# Altium project Multi_HUTSCHIENE_1_1.PrjPCB
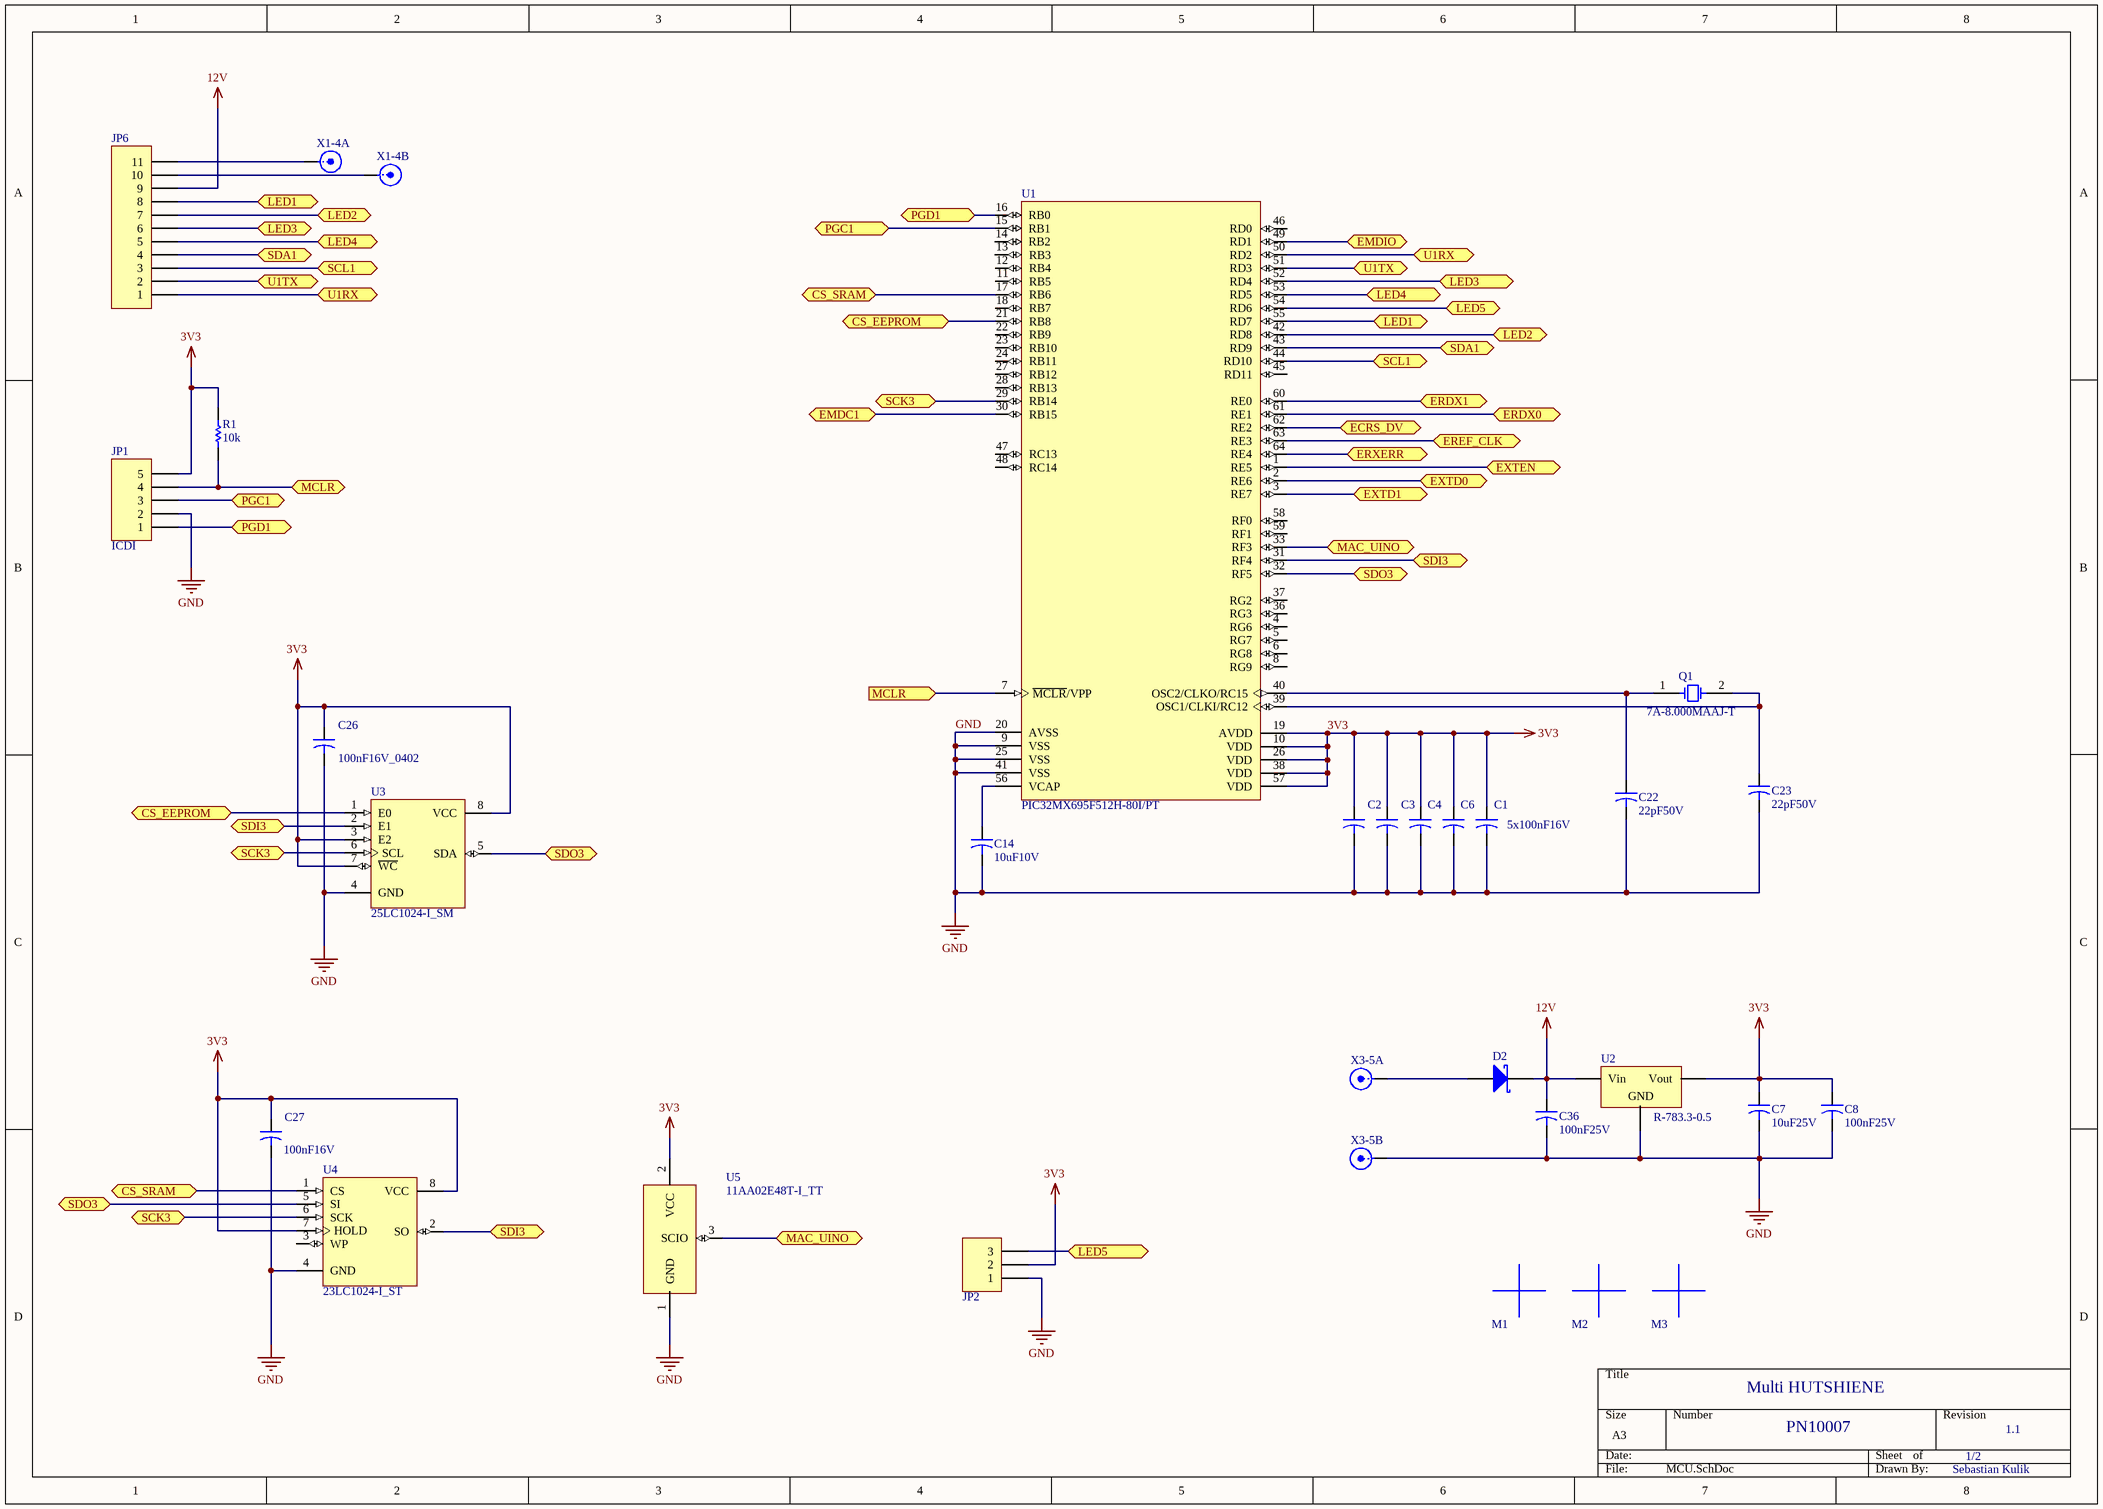
[diagram p0: MCU.SchDoc]
2 sheets, 60 parts. Net scope: flat (ports and power ports of the same name join across sheets).
Board file: Multi_HUTSCHIENE_1_1.PcbDoc
Sheets:
  MCU.SchDoc
  Ethernet.SchDoc

## Sheet MCU.SchDoc
size A3

### Parts
C1  100nF16V_0402  [C0402]  (value not drawn)
C2  100nF16V_0402  [C0402]  (value not drawn)
C3  100nF16V_0402  [C0402]  (value not drawn)
C4  100nF16V_0402  [C0402]  (value not drawn)
C6  100nF16V_0402  [C0402]  (value not drawn)
C7  value 10uF25V  [C1210]  (hidden comment: 10uF25V_1210)
C8  value 100nF25V  [C0402]  (hidden comment: 100nF25V_0402)
C14  value 10uF10V  [C0603]  (hidden comment: 10uF10V_0603)
C22  value 22pF50V  [C0402]  (hidden comment: 22pF50V_0402)
C23  value 22pF50V  [C0402]  (hidden comment: 22pF50V_0402)
C26  100nF16V_0402  [C0402]
C27  value 100nF16V  [C0402]  (hidden comment: 100nF16V_0402)
C36  value 100nF25V  [C0402]  (hidden comment: 100nF25V_0402)
D2  SD103AW-V-GS08  [SOD123]  (value not drawn)
JP1  ICDI  [HDR1X5-1.27]
JP2  Header-3  [HDR1X3]  (value not drawn)
JP6  Header 11_2.54  [HDR1X11_2.54]  (value not drawn)
M1  Mark  [Mark-3mm]  (value not drawn)
M2  Mark  [Mark-3mm]  (value not drawn)
M3  Mark  [Mark-3mm]  (value not drawn)
Q1  7A-8.000MAAJ-T  [TXC_7A]
R1  value 10k  [R0402]  (hidden comment: 10k_0402)
U1  PIC32MX695F512H-80I/PT  [TQFP-64_N1]
U2  R-783.3-0.5  [R-783_3-0_5]
U3  25LC1024-I_SM  [SOP8_N]
U4  23LC1024-I_ST  [TSSOP8]
U5  11AA02E48T-I_TT  [SOT23_M]
X1-4  Terminal-Wago_2  [WAGO-243-211]  (value not drawn)  (parts A,B of 2)
X3-5  Terminal-Wago_2  [WAGO-243-211]  (value not drawn)  (parts A,B of 2)

### Ports
CS_EEPROM, CS_SRAM, ECRS_DV, EMDC1, EMDIO, ERDX0, ERDX1, EREF_CLK, ERXERR, EXTD0, EXTD1, EXTEN, LED1, LED2, LED3, LED4, LED5, MAC_UINO, MCLR, MCLR (in), PGC1, PGD1, SCK3, SCL1, SDA1, SDI3, SDO3, U1RX, U1TX

### Nets
3V3: C1.1 C2.1 C3.1 C4.1 C6.1 C7.1 C8.1 C26.1 C27.1 JP1.5 JP2.2 R1.2 U1.10(VDD) U1.19(AVDD) U1.26(VDD) U1.38(VDD) U1.57(VDD) U2.3(Vout) U3.3(E2) U3.7(~{WC}) U3.8(VCC) U4.7(HOLD) U4.8(VCC) U5.2(VCC)
12V: C36.1 D2.1(K) JP6.9 U2.1(Vin)
GND: C1.2 C2.2 C3.2 C4.2 C6.2 C7.2 C8.2 C14.2 C22.2 C23.2 C26.2 C27.2 C36.2 JP1.2 JP2.1 U1.9(VSS) U1.20(AVSS) U1.25(VSS) U1.41(VSS) U2.2(GND) U3.4(GND) U4.4(GND) U5.1(GND) X3-5.2(Y)
NetC14_1: C14.1 U1.56(VCAP)
NetC22_1: C22.1 Q1.1(E/D) U1.40(OSC2/CLKO/RC15)
NetC23_1: C23.1 Q1.2(GND) U1.39(OSC1/CLKI/RC12)
NetD2_2: D2.2(A) X3-5.1(X)
NetJP1_1: JP1.1 U1.16(RB0) ; port PGD1
NetJP1_3: JP1.3 U1.15(RB1) ; port PGC1
NetJP1_4: JP1.4 R1.1 U1.7(~{MCLR}/VPP) ; port MCLR
NetJP2_3: JP2.3 U1.54(RD6) ; port LED5
NetJP6_1: JP6.1 U1.50(RD2) ; port U1RX
NetJP6_2: JP6.2 U1.51(RD3) ; port U1TX
NetJP6_3: JP6.3 U1.44(RD10) ; port SCL1
NetJP6_4: JP6.4 U1.43(RD9) ; port SDA1
NetJP6_5: JP6.5 U1.53(RD5) ; port LED4
NetJP6_6: JP6.6 U1.52(RD4) ; port LED3
NetJP6_7: JP6.7 U1.42(RD8) ; port LED2
NetJP6_8: JP6.8 U1.55(RD7) ; port LED1
NetJP6_10: JP6.10 X1-4.2(Y)
NetJP6_11: JP6.11 X1-4.1(X)
NetR9_1: U1.49(RD1) ; port EMDIO
NetR10_2: U1.62(RE2) ; port ECRS_DV
NetR11_2: U1.64(RE4) ; port ERXERR
NetR12_1: U1.60(RE0) ; port ERDX1
NetR13_2: U1.61(RE1) ; port ERDX0
NetR15_2: U1.63(RE3) ; port EREF_CLK
NetU1_1: U1.1(RE5) ; port EXTEN
NetU1_2: U1.2(RE6) ; port EXTD0
NetU1_3: U1.3(RE7) ; port EXTD1
NetU1_17: U1.17(RB6) U4.1(CS) ; port CS_SRAM
NetU1_21: U1.21(RB8) U3.1(E0) ; port CS_EEPROM
NetU1_29: U1.29(RB14) U3.6(SCL) U4.6(SCK) ; port SCK3
NetU1_30: U1.30(RB15) ; port EMDC1
NetU1_31: U1.31(RF4) U3.2(E1) U4.2(SO) ; port SDI3
NetU1_32: U1.32(RF5) U3.5(SDA) U4.5(SI) ; port SDO3
NetU1_33: U1.33(RF3) U5.3(SCIO) ; port MAC_UINO

Not connected (* = marked no-connect by the designer): U1 4(RG6) 5(RG7) 6(RG8) 8(RG9) 11(RB5) 12(RB4) 13(RB3) 14(RB2) 18(RB7) 22(RB9) 23(RB10) 24(RB11) 27(RB12) 28(RB13) 36(RG3) 37(RG2) 45(RD11) 46(RD0) 47(RC13) 48(RC14) 58(RF0) 59(RF1); U4 3(WP)

### Notes on the sheet
- (near C1) 5x100nF16V
- Multi HUTSHIENE
- PN10007
- 1/2
- 1.1
- Sebastian Kulik

### Library data of the parts
C1-C4 C6 C26 C27 = 100nF16V_0402: Capacitor; Part Description: TDK. CGA series, X7R, 10%, 16V; Deliverer PartNr: 2210748RL; Manufacturer: TDK; Manufacturer PartNr: CGA2B1X7R1C104K050BC; Deliverer: Farnell; TDFE-PN: C0025; Published: 12.02.2014; Publisher: Sebastian Kulik; PackageDescription: C0403
  C1-C4 C6 C26: Value: 100nF16V
C7 = 10uF25V_1210: Capacitor; Part Description: TDK  C series, X5R, 10%, 25V; Deliverer PartNr: 2346957; Manufacturer: TDK; Manufacturer PartNr: C3225X5R1E106K250AA; Deliverer: Farnell; TDFE-PN: C0014; Published: 12.02.2014; Publisher: Sebastian Kulik; PackageDescription: C1210
C8 C36 = 100nF25V_0402: AVX, X5R, 10%, 25V; Deliverer PartNr: 2280767; Manufacturer PartNr: 04023D104KAT2A; Deliverer: Farnell; TDFE-PN: C0036; Published: 13.02.2014; Part Description: AVX, X5R, 10%, 25V; Publisher: Sebastian Kulik; PackageDescription: C0403; Manufacturer: AVX
C14 = 10uF10V_0603: Capacitor; Part Description: AVX ,  X5R, 20%, 10V; Deliverer PartNr: 1867954RL; Manufacturer: AVX; Manufacturer PartNr: 0603ZD106MAT2A; Deliverer: Farnell; TDFE-PN: C0016; Published: 11.02.2014; Publisher: Sebastian Kulik; PackageDescription: C0603
C22 C23 = 22pF50V_0402: Murata, GRM series, 50V; Deliverer PartNr: 8819629RL; Manufacturer PartNr: GRM1555C1H220JZ01D; Deliverer: Farnell; TDFE-PN: C0021; Published: 11.02.2014; Part Description: Murata, GRM series, 50V; Publisher: Sebastian Kulik; PackageDescription: C0403; Manufacturer: Murata
D2 = SD103AW-V-GS08: Diode Schottky,2A,40V; Deliverer PartNr: 1617720RL; Manufacturer: Vishay; TDE-PN: DIS0008; Deliverer: Farnell; Published: 12.02.2014; PackageReference: TO-220AC; Publisher: Sebastian Kulik; PackageDescription: SOD123; Manufacturer PartNr: SD103AW-V-GS08
JP1 = ICDI: Header, 5-Pin; LatestRevisionDate: 17-Jul-2002; LatestRevisionNote: Re-released for DXP Platform.; Publisher: Sebastian Kulik
JP2 = Header-3: Header-3-Pin; Publisher: Sebastian Kulik
JP6 = Header 11_2.54: Header, 11-Pin; LatestRevisionDate: 17-Jul-2002; LatestRevisionNote: Re-released for DXP Platform.; Publisher: Altium Limited
Q1 = Crystal_8MHz: Crystal, 7A-8.000MAAJ-T; Deliverer PartNr: 1892148; Manufacturer: TXC; Deliverer: Farnell; TDE-PN: P0003; Published: 14.02.2014; PackageReference: 7A; Publisher: Sebastian Kulik; Manufacturer PartNr: 7A-8.000MAAJ-T
R1 = 10k_0402: Vishay CRCW series, 125mW, 1%; Manufacturer PartNr: CRCW040210K0FKEAHP; Deliverer PartNr: 1738864; TDE-PN: R0012; Deliverer: Farnell; Published: 12.02.2014; PackageReference: 0402; Publisher: Sebastian Kulik; PackageDescription: 0402; Manufacturer: Vishay; Part Description: Vishay CRCW series, 125mW, 1%
U1 = PIC32MX695F512H-80I/PT: High Performance ROM-less Microcontroller with External Memory Bus, 1.5K RAM, 64-Pin TQFP, 4.2 to 5.5V Supply Range, Industrial Temperature; Deliverer PartNr: 1778975; Manufacturer: Microchip; Deliverer: Farnell; TDE-PN: IC0031; Published: 11.02.2014; PackageReference: TQFP-64; Publisher: Sebastian Kulik; PackageDescription: 64-Pin Thin Plastic Quad Flat Pack 0.5 mm Pitch, 1.0/0.1 mm Lead Form; Manufacturer PartNr: PIC32MX695F512H-80I/PT
U2 = Recom-R-783_3-0_5: Voltage Regulator; Manufacturer: Recom; TDE-PN: IC0032; Published: 12.02.2014; Manufacturer PartNr: R-783.3-0.5; PackageReference: D2PAK; Publisher: Sebastian Kulik
U3 = 25LC1024-I_SM: 1024 Kbit Serial SPI Bus EEPROM; Deliverer PartNr: 1331393; Manufacturer: Microchip; Deliverer: Farnell; TDE-PN: IC0033; Published: 12.02.2014; PackageReference: SOP8; Publisher: Sebastian Kulik; Manufacturer PartNr: 25LC1024-I_SM
U4 = 23LC1024-I_ST: 1 Mbit Serial  EEPROM; Deliverer PartNr: 2212151; Manufacturer PartNr: 23LC1024-I/ST; Manufacturer: Microchip; Deliverer: Farnell; TDE-PN: IC0034; Published: 12.02.2014; PackageReference: TSSOP8; Publisher: Sebastian Kulik
U5 = 11AA02E48T-I_TT: 2 kbit Serial  EEPROM; Deliverer PartNr: 1707616RL; Manufacturer PartNr: 11AA02E48T-I/TT; Manufacturer: Microchip; Deliverer: Farnell; TDE-PN: IC0035; Published: 12.02.2014; PackageReference: SOT23; Publisher: Sebastian Kulik
X1-4 X3-5 = Terminal-Wago_2: Wago terminal-2; LatestRevisionDate: 17-Jul-2002; LatestRevisionNote: Re-released for DXP Platform.; Publisher: Altium Limited

## Sheet Ethernet.SchDoc
size A3
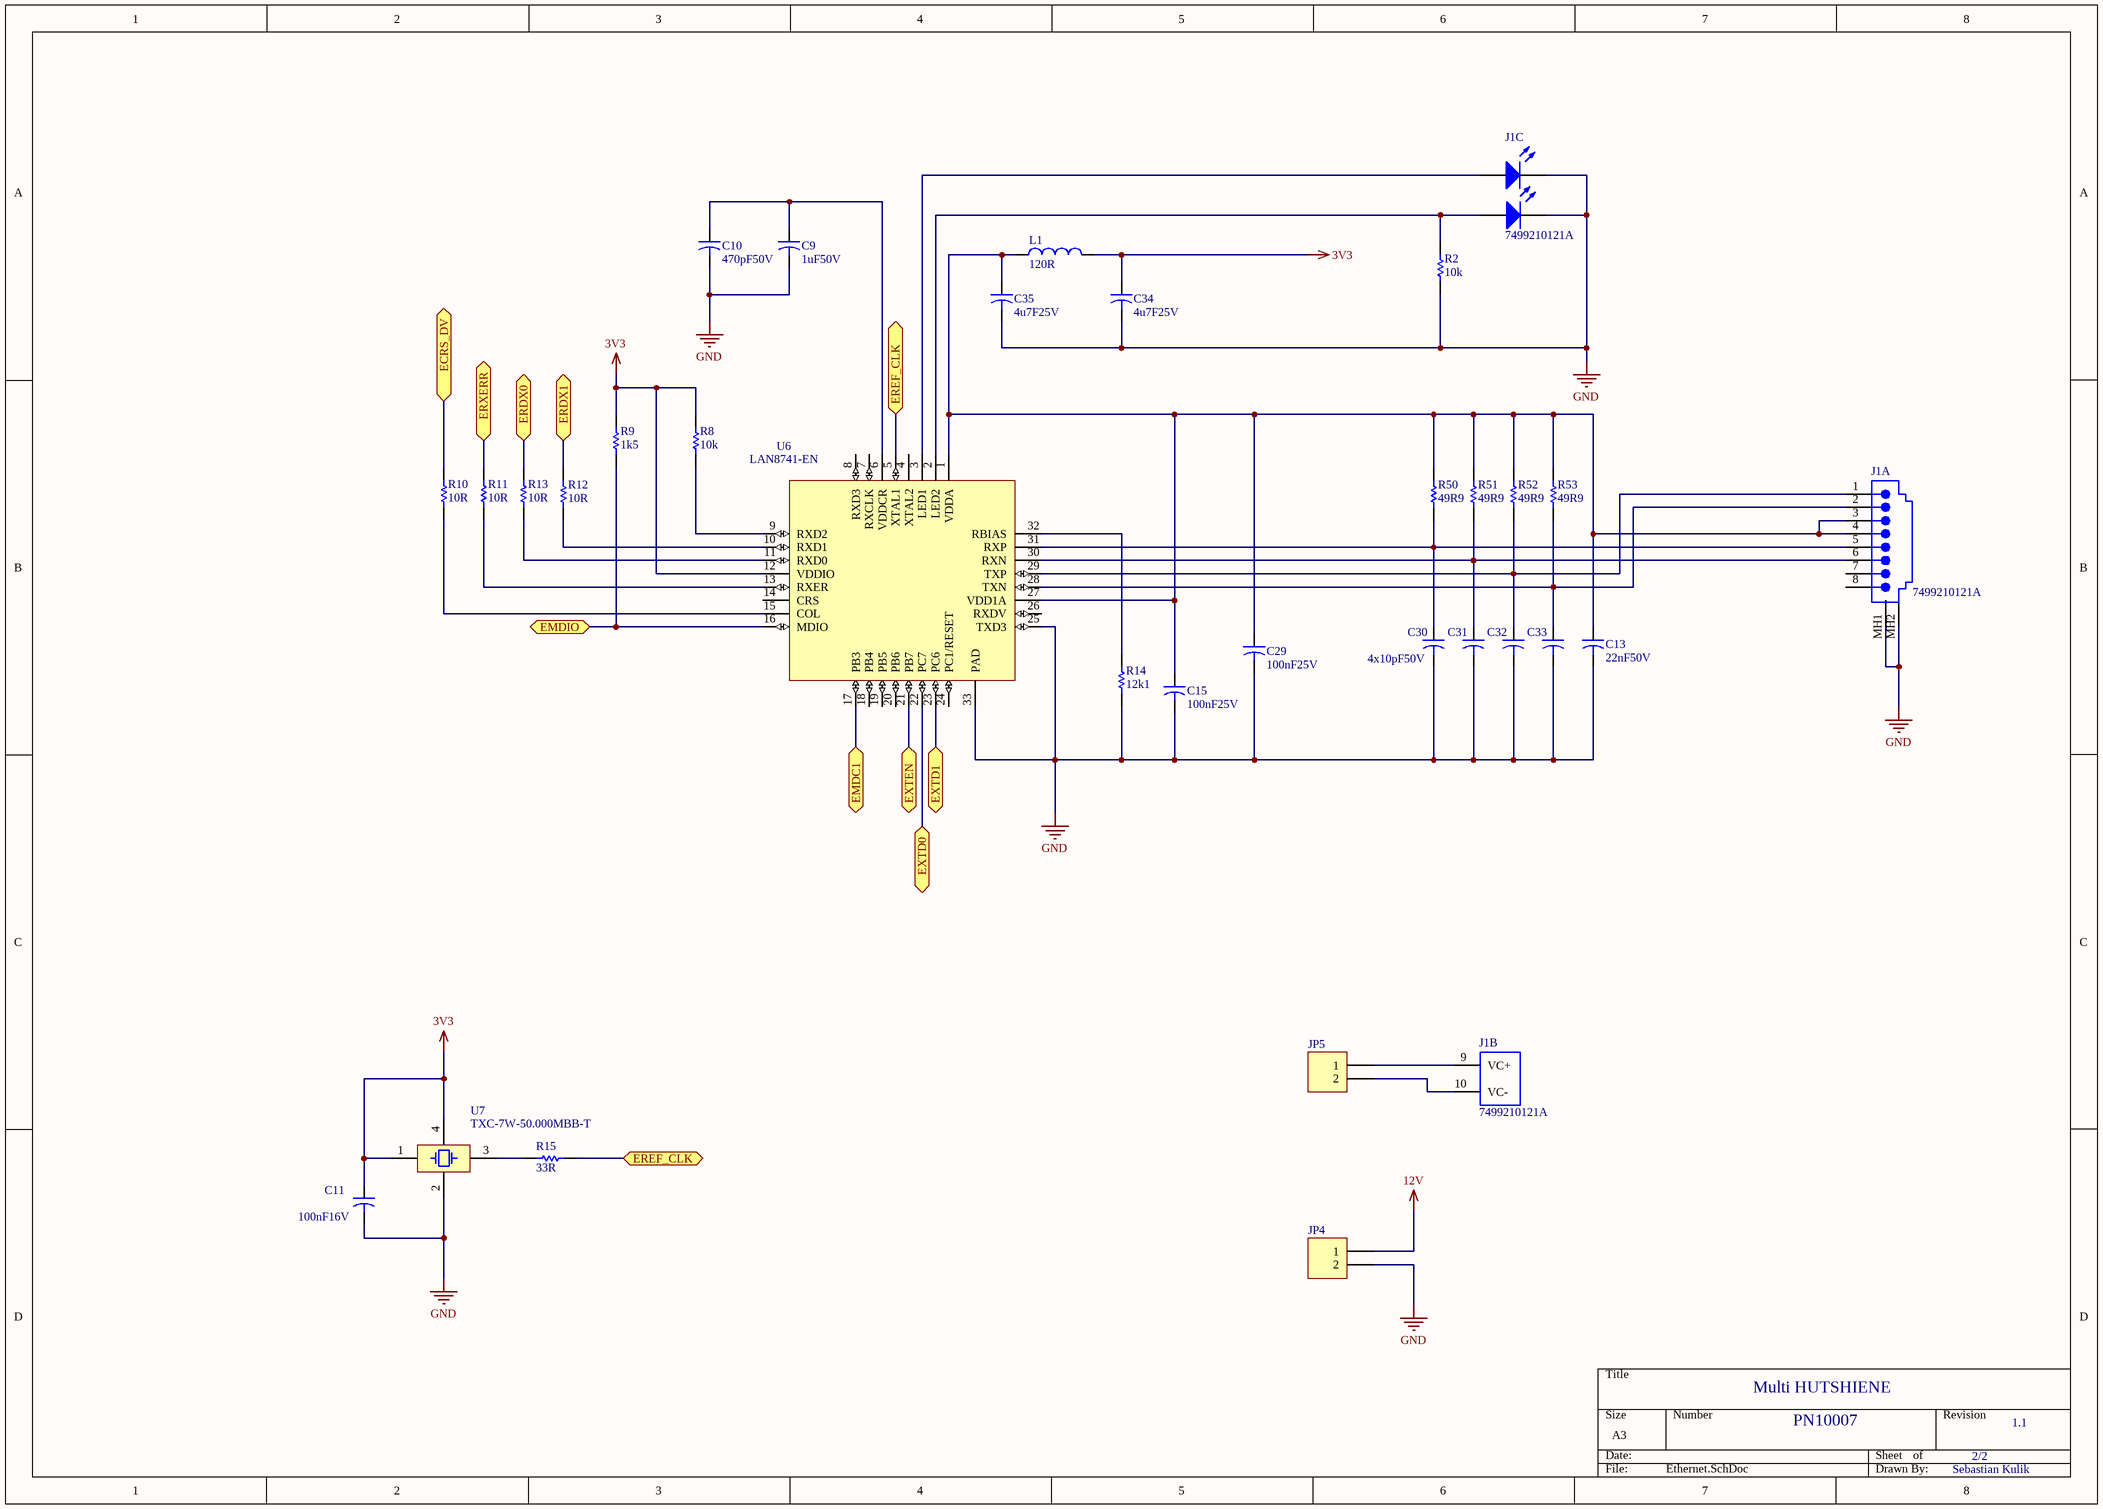
[diagram p1: Ethernet.SchDoc]

### Parts
C9  value 1uF50V  [C0603]  (hidden comment: 1uF50V_0603)
C10  value 470pF50V  [C0402]  (hidden comment: 470pF50V_0402)
C11  value 100nF16V  [C0402]  (hidden comment: 100nF16V_0402)
C13  value 22nF50V  [C0603]  (hidden comment: 22nF50V_0603)
C15  value 100nF25V  [C0402]  (hidden comment: 100nF25V_0402)
C29  value 100nF25V  [C0402]  (hidden comment: 100nF25V_0402)
C30  10pF50V_0603  [C0603]  (value not drawn)
C31  10pF50V_0603  [C0603]  (value not drawn)
C32  10pF50V_0603  [C0603]  (value not drawn)
C33  10pF50V_0603  [C0603]  (value not drawn)
C34  value 4u7F25V  [C0805]  (hidden comment: 4u7F25V_0805)
C35  value 4u7F25V  [C0805]  (hidden comment: 4u7F25V_0805)
J1  7499210121A  [7499210121A]  (parts A,B,C of 3)
JP4  Header-2  [HDR1X2]  (value not drawn)
JP5  Header-2  [HDR1X2]  (value not drawn)
L1  value 120R  [L0603]  (hidden comment: 120R4A_0603)
R2  value 10k  [R0402]  (hidden comment: 10k_0402)
R8  value 10k  [R0402]  (hidden comment: 10k_0402)
R9  value 1k5  [R0402]  (hidden comment: 1k5_0402)
R10  value 10R  [R0402]  (hidden comment: 10R_0402)
R11  value 10R  [R0402]  (hidden comment: 10R_0402)
R12  value 10R  [R0402]  (hidden comment: 10R_0402)
R13  value 10R  [R0402]  (hidden comment: 10R_0402)
R14  value 12k1  [R0603(1608)]  (hidden comment: 12k1_0603)
R15  value 33R  [R0402]  (hidden comment: 33R_0402)
R50  value 49R9  [R0402]  (hidden comment: 49R9_0402)
R51  value 49R9  [R0402]  (hidden comment: 49R9_0402)
R52  value 49R9  [R0402]  (hidden comment: 49R9_0402)
R53  value 49R9  [R0402]  (hidden comment: 49R9_0402)
U6  LAN8741-EN  [32M1-A_M]
U7  TXC-7W-50.000MBB-T  [TXC_7W]

### Ports
ECRS_DV, EMDC1, EMDIO, ERDX0, ERDX1, EREF_CLK, ERXERR, EXTD0, EXTD1, EXTEN

### Nets
3V3: C11.1 C34.1 L1.2 R8.2 R9.2 U6.12(VDDIO) U7.1(E/D) U7.4(VCC)
12V: JP4.1
GND: C9.2 C10.2 C11.2 C13.2 C15.2 C29.2 C30.2 C31.2 C32.2 C33.2 C34.2 C35.2 J1.12(K) J1.14(K) J1.MH1(Shield) J1.MH2(Shield) JP4.2 R2.1 R14.1 U6.25(TXD3) U6.33(PAD) U7.2(GND)
NetC9_1: C9.1 C10.1 U6.6(VDDCR)
NetC13_1: C13.1 C15.1 C29.1 C35.1 J1.3 J1.4 L1.1 R50.2 R51.2 R52.2 R53.2 U6.1(VDDA) U6.27(VDD1A)
NetC30_1: C30.1 J1.5 R50.1 U6.31(RXP)
NetC31_1: C31.1 J1.6 R51.1 U6.30(RXN)
NetC32_1: C32.1 J1.1 R52.1 U6.29(TXP)
NetC33_1: C33.1 J1.2 R53.1 U6.28(TXN)
NetJ1_9: J1.9(VC+) JP5.1
NetJ1_10: J1.10(VC-) JP5.2
NetJ1_11: J1.11(A) U6.3(LED1)
NetJ1_13: J1.13(A) R2.2 U6.2(LED2)
NetR8_1: R8.1 U6.9(RXD2)
NetR9_1: R9.1 U6.16(MDIO) ; port EMDIO
NetR10_1: R10.1 U6.15(COL)
NetR10_2: R10.2 ; port ECRS_DV
NetR11_1: R11.1 U6.13(RXER)
NetR11_2: R11.2 ; port ERXERR
NetR12_1: R12.1 ; port ERDX1
NetR12_2: R12.2 U6.10(RXD1)
NetR13_1: R13.1 U6.11(RXD0)
NetR13_2: R13.2 ; port ERDX0
NetR14_2: R14.2 U6.32(RBIAS)
NetR15_1: R15.1 U7.3(OSC2)
NetR15_2: R15.2 U6.5(XTAL1) ; port EREF_CLK
NetU1_1: U6.21(PB7) ; port EXTEN
NetU1_2: U6.22(PC7) ; port EXTD0
NetU1_3: U6.23(PC6) ; port EXTD1
NetU1_30: U6.17(PB3) ; port EMDC1

Not connected (* = marked no-connect by the designer): J1 7 8; U6 4(XTAL2) 7(RXCLK) 8(RXD3) 14(CRS) 18(PB4) 19(PB5) 20(PB6) 24(PC1/RESET) 26(RXDV)

### Notes on the sheet
- (near C30) 4x10pF50V
- Multi HUTSHIENE
- PN10007
- 2/2
- 1.1
- Sebastian Kulik

### Library data of the parts
C9 = 1uF50V_0603: C series, X5R, 10%; Deliverer PartNr: 2211179RL; Manufacturer: TDK; Manufacturer PartNr: C1608X5R1H105K080AB; Deliverer: Farnell; TDFE-PN: C0037; Published: 13.02.2014; Part Description: C series, X5R, 10%; Publisher: Sebastian Kulik; PackageDescription: C0603
C10 = 470pF50V_0402: AVX, 50V; Deliverer PartNr: 1657927; Manufacturer PartNr: 04025A471JAT2A; Deliverer: Farnell; TDFE-PN: C0030; Published: 13.02.2014; Part Description: AVX,50V; Publisher: Sebastian Kulik; PackageDescription: C0403; Manufacturer: AVX
C11 = 100nF16V_0402: as C1 on sheet MCU; Published: 12.02.2014; Publisher: Sebastian Kulik; PackageDescription: C0403
C13 = 22nF50V_0603: AVX ,  X7R, 5%, 50V; Deliverer PartNr: 2332645RL; Manufacturer PartNr: 06035C223JAT2A; Deliverer: Farnell; TDFE-PN: C0034; Published: 13.02.2014; Part Description: AVX ,  X7R, 5%, 50V; Publisher: Sebastian Kulik; PackageDescription: C0603; Manufacturer: AVX
C15 C29 = 100nF25V_0402: as C8 on sheet MCU; Published: 13.02.2014; Part Description: AVX, X5R, 10%, 25V; Publisher: Sebastian Kulik; PackageDescription: C0403; Manufacturer: AVX
C30-C33 = 10pF50V_0603: AVX ,  +-0.5pF, 50V; Deliverer PartNr: 2332595RL; Manufacturer PartNr: 06035A100DAT2A; Deliverer: Farnell; TDFE-PN: C0033; Published: 13.02.2014; Part Description: AVX ,  +-0.5pF, 50V; Publisher: Sebastian Kulik; PackageDescription: C0603; Manufacturer: AVX; Value: 10pF50V
C34 C35 = 4u7F25V_0805: TDK  C series, X7R, 10%, 25V; Deliverer PartNr: 2346943RL; Manufacturer PartNr: C2012X7R1E475K125AB; Deliverer: Farnell; TDFE-PN: C0035; Published: 13.02.2014; Part Description: TDK  C series, X7R, 10%, 25V; Publisher: Sebastian Kulik; PackageDescription: C0805; Manufacturer: TDK
J1 = Ethernet, POE, WE7499210121A: Modular Jack , Right Angle RJ-45, Low Profile; Deliverer PartNr: 1636396; Manufacturer: Wuerth Elektronik; Ports: 1; PCB_Mounting: Thru-Hole; Deliverer: Farnell; TDE-PN: CON0005; PackageReference: 7499210121A; Publisher: Sebastian Kulik; Manufacturer PartNr: 7499210121A
JP4 JP5 = Header-2: Header, 5-Pin; LatestRevisionDate: 17-Jul-2002; LatestRevisionNote: Re-released for DXP Platform.; Publisher: Sebastian Kulik
L1 = 120R4A_0603: Murata, Ferrit, 120Rx2A; Deliverer PartNr: 1515738RL; Manufacturer PartNr: BLM18PG121SN1D; Deliverer: Farnell; TDE-PN: P0016; Manufacturer: Murata; Published: 13.02.2014; Publisher: Sebastian Kulik
R2 R8 = 10k_0402: as R1 on sheet MCU; Published: 12.02.2014; PackageReference: 0402; Publisher: Sebastian Kulik; PackageDescription: 0402; Manufacturer: Vishay; Part Description: Vishay CRCW series, 125mW, 1%
R9 = 1k5_0402: Vishay CRCW series, 125mW, 1%; Manufacturer PartNr: CRCW04021K50FKEAHP; Deliverer PartNr: 1738852; Part Description: Vishay CRCW series, 63mW, 1%; TDE-PN: R0036; Deliverer: Farnell; Published: 13.02.2014; PackageReference: 0402; Publisher: Sebastian Kulik; PackageDescription: 0402; Manufacturer: Vishay
R10-R13 = 10R_0402: Vishay CRCW series, 125mW, 1%; Manufacturer PartNr: CRCW040210R0FKEAHP; Deliverer PartNr: 1738824RL; TDE-PN: R0015; Deliverer: Farnell; Published: 12.02.2014; PackageReference: 0402; Publisher: Sebastian Kulik; PackageDescription: 0402; Manufacturer: Vishay; Part Description: Vishay CRCW series, 125mW, 1%
R14 = 12k1_0603: Vishay, CRCW series, 100mW, 1%; Manufacturer PartNr: CRCW060312K1FKEA; Deliverer PartNr: 2122502; TDE-PN: R0037; Deliverer: Farnell; Published: 11.02.2014; Publisher: Sebastian Kulik; PackageDescription: 0603; Manufacturer: Vishay; Part Desicription: Vishay, CRCW series, 100mW, 1%
R15 = 33R_0402: Vishay CRCW series, 63mW, 1%; Manufacturer PartNr: CRCW040233R0FKEAHP; Deliverer PartNr: 1738830; TDE-PN: R0037; Deliverer: Farnell; Published: 12.02.2014; PackageReference: 0402; Publisher: Sebastian Kulik; PackageDescription: 0402; Manufacturer: Vishay; Part Description: Vishay CRCW series, 63mW, 1%
R50-R53 = 49R9_0402: Vishay CRCW series, 63mW, 1%; Manufacturer PartNr: CRCW040249R9FKED; Deliverer PartNr: 2121437; TDE-PN: R0035; Deliverer: Farnell; Published: 13.02.2014; PackageReference: 0402; Publisher: Sebastian Kulik; PackageDescription: 0402; Manufacturer: Vishay; Part Description: Vishay CRCW series, 63mW, 1%
U6 = LAN8741-EN: Ethernet Phy; Deliverer PartNr: 2373284; Manufacturer PartNr: LAN8741A-EN; Manufacturer: Microchip; TDE-PN: IC0036; Deliverer: Farnell; Published: 12.02.2014; LatestRevisionNote: IPC-7351 Footprint Added.; Publisher: Sebastian Kulik
U7 = TXC-7W-50.000MBB-T: Crystal; Deliverer PartNr: 1842144; Manufacturer: TXC; Deliverer: Farnell; TDE-PN: IC0037; Published: 17.02.2014; PackageReference: SOT23; Publisher: Sebastian Kulik; Manufacturer PartNr: 7W-50.000MBB-T

## Nets that join several sheets
3V3: MCU (24 pins), Ethernet (8 pins)
12V: MCU (C36.1 D2.1 JP6.9 U2.1), Ethernet (JP4.1)
GND: MCU (24 pins), Ethernet (22 pins)
NetR9_1: MCU (U1.49), Ethernet (R9.1 U6.16)
NetR10_2: MCU (U1.62), Ethernet (R10.2)
NetR11_2: MCU (U1.64), Ethernet (R11.2)
NetR12_1: MCU (U1.60), Ethernet (R12.1)
NetR13_2: MCU (U1.61), Ethernet (R13.2)
NetR15_2: MCU (U1.63), Ethernet (R15.2 U6.5)
NetU1_1: MCU (U1.1), Ethernet (U6.21)
NetU1_2: MCU (U1.2), Ethernet (U6.22)
NetU1_3: MCU (U1.3), Ethernet (U6.23)
NetU1_30: MCU (U1.30), Ethernet (U6.17)